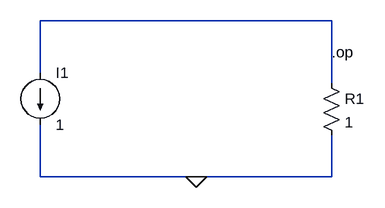
[diagram p0: schematic Draft2.asc]
Draft2.asc, the LTspice schematic file:
Version 4
SHEET 1 880 680
WIRE 528 192 80 192
WIRE 80 272 80 192
WIRE 528 288 528 192
WIRE 80 432 80 352
WIRE 320 432 80 432
WIRE 528 432 528 368
WIRE 528 432 320 432
FLAG 320 432 0
SYMBOL current 80 272 R0
SYMATTR InstName I1
SYMATTR Value 1
SYMBOL res 512 272 R0
SYMATTR InstName R1
SYMATTR Value 1
TEXT 528 240 Left 2 !.op

The netlist it stands for:
* Draft2.asc
I1 N001 0 1
R1 N001 0 1
.op
.backanno
.end